# EAGLE design Touch (EAGLE 9.4.2)
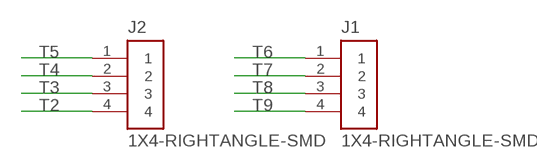
[diagram p0: schematic, sheet 1]

## Parts
J1  1X4-RIGHTANGLE-SMD  [1X4-RIGHTANGLE-SMD]
J2  1X4-RIGHTANGLE-SMD  [1X4-RIGHTANGLE-SMD]

## Nets
T2: J2.4
T3: J2.3
T4: J2.2
T5: J2.1
T6: J1.1
T7: J1.2
T8: J1.3
T9: J1.4

## Library data of the parts
J1 J2 = Actuator Circle:1X4-RIGHTANGLE-SMD

## Board
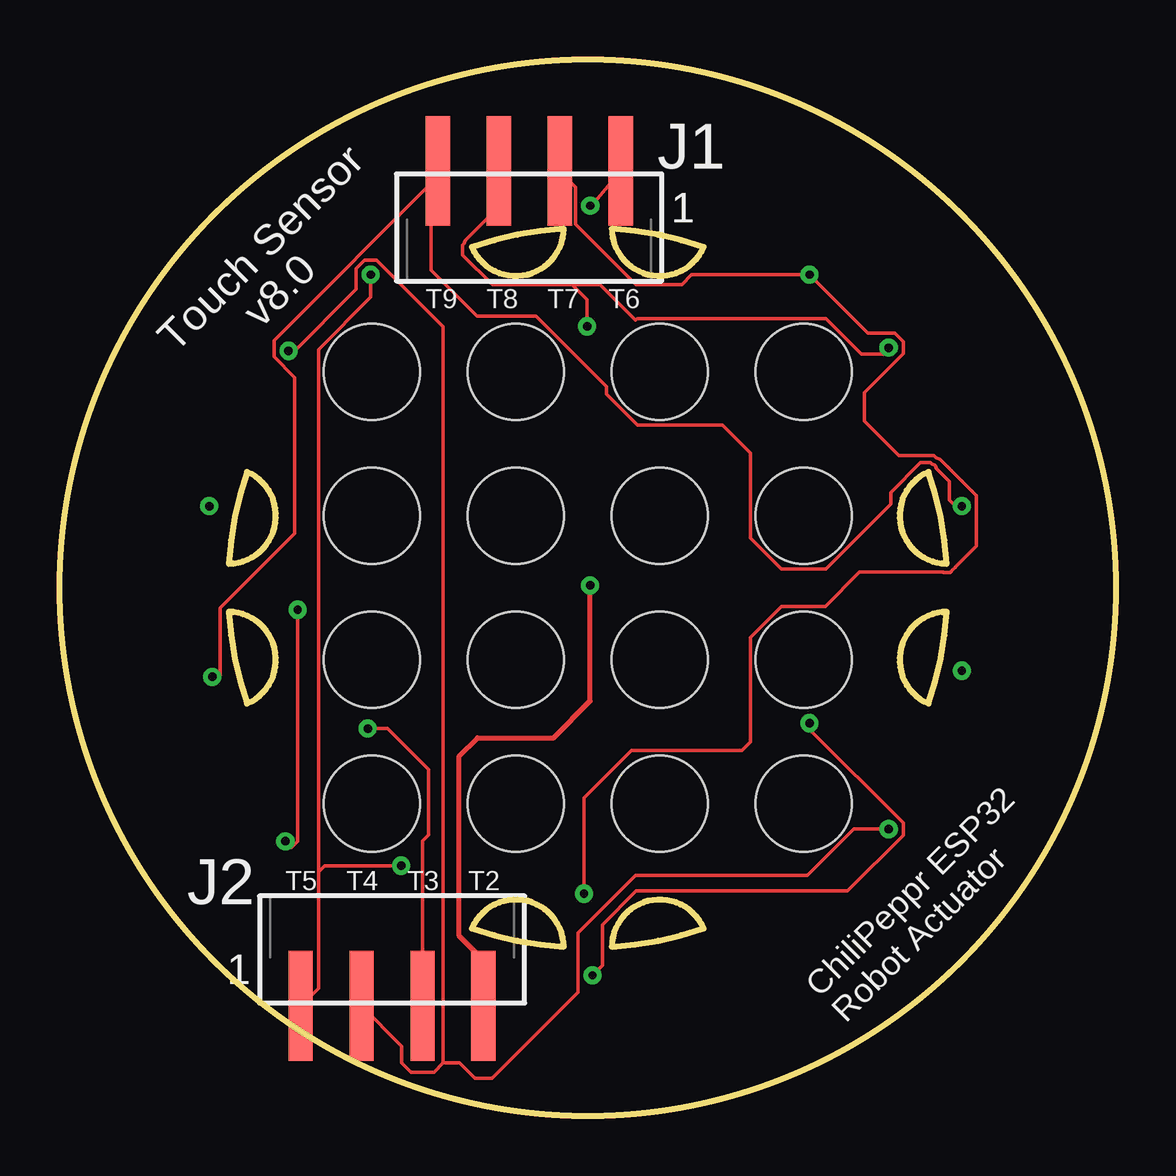
[diagram p1: board, top side]
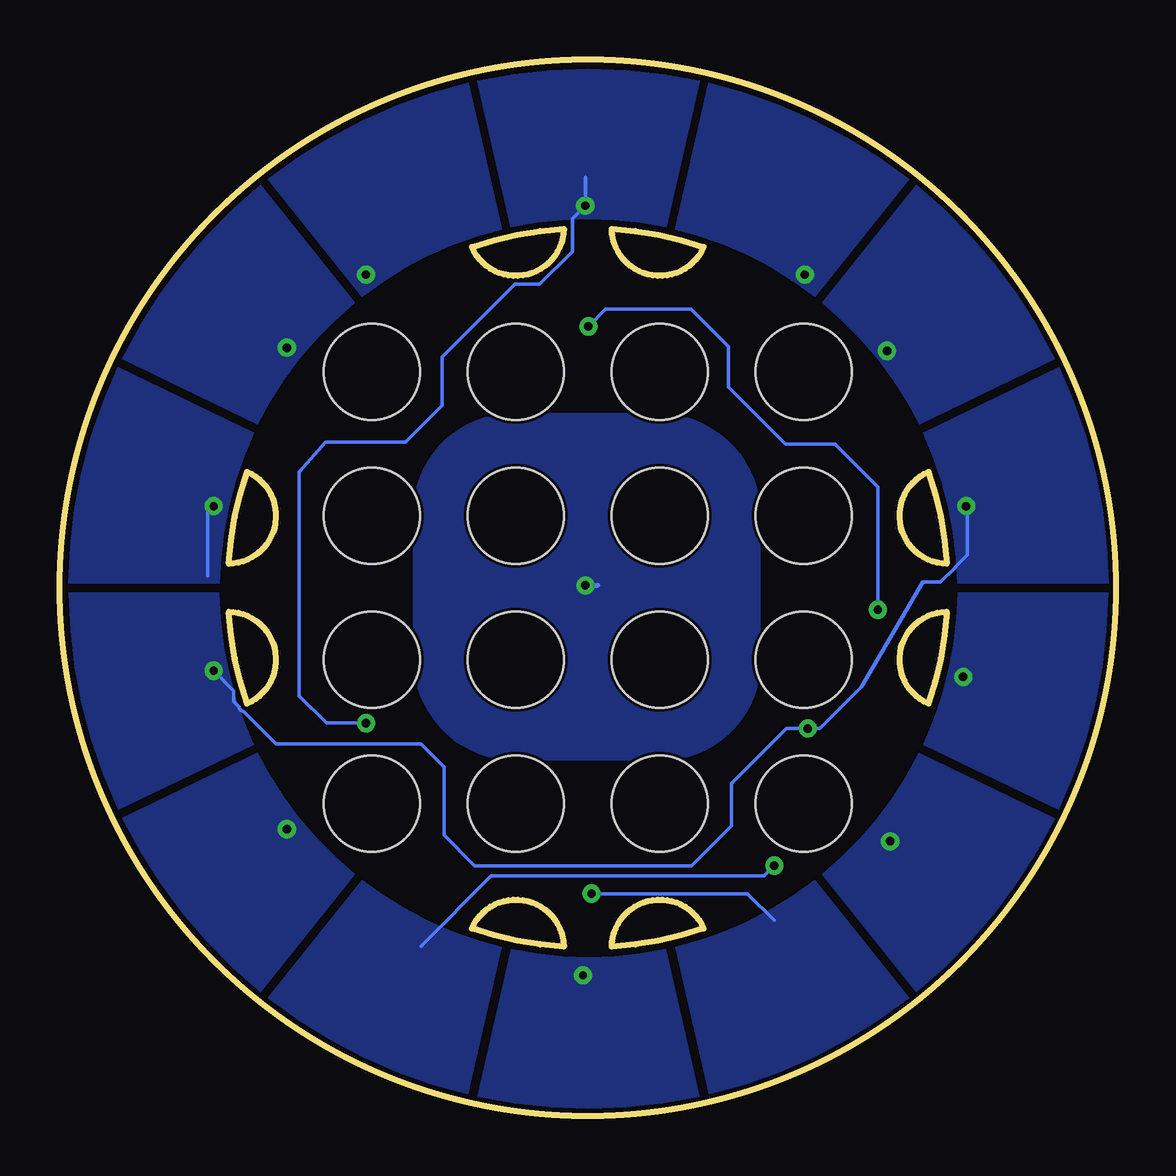
[diagram p2: board, bottom side, seen from below]

Size 44 x 44 mm. Coordinates in mm from the lower left corner, seen from the top.
Outline: 7.03,23 arc155 7.8,26.83 arc15 7.03,23
Outline: 36.2,26.83 arc155 36.97,23 arc15 36.2,26.83
Outline: 17.17,36.2 arc155 21,36.97 arc15 17.17,36.2
Outline: 23,36.97 arc155 26.83,36.2 arc15 23,36.97
Outline: 26.83,7.8 arc155 23,7.03 arc15 26.83,7.8
Outline: 7.03,21 arc15 7.8,17.17 arc155 7.03,21
Outline: 21,7.03 arc155 17.17,7.8 arc15 21,7.03
Outline: 36.97,21 arc155 36.2,17.17 arc15 36.97,21
Outline: circle at 22,22 radius 22
Copper layers (1*16): Top 0.035mm / dielectric 1.13mm / Bottom 0.035mm
Design rules "default *": minimum track width 6mil, minimum drill 0.35mm, track to track 6mil, track to pad 6mil, pad to pad 6mil, via to via 6mil, smd to smd 6mil, copper to edge 6mil, drill to drill 6mil, minimum pad ring 10mil, minimum via ring 8mil, stop-mask expansion 4mil, vias tented up to drill 0mil, thermal gap 10mil
Holes 4 mm at 31,25 25,31 19,31 31,13 19,13 25,25 19,25 19,19 25,13 25,19 31,19 31,31 13,31 13,19 13,13 13,25

### Footprints (pad centres in the part's own frame; a part is rotated, then mirrored left to right if it is on the bottom)
1X4-RIGHTANGLE-SMD = smd 1.016 x 4.572: 1 -3.81,-3.302; 2 -1.27,-3.302; 3 1.27,-3.302; 4 3.81,-3.302

### Placement (x,y rotation side)
J1  19.56,36.07 180 top
J2  13.84,7.87 0 top

### Tracks (layer width: path | path; a pad name or v marks a point on that pad's centre or on a via)
T2  (via drill 0.35)
  Top 0.203: J2.4 17.65,6.48 16.64,7.49 16.64,14.99 17.4,15.75 20.57,15.75 22.1,17.27 v22.1,22.1
  Bottom 0.203: v22.1,22.1 21.59,22.1
  pour Bottom: 19.05,29.21 arc90 14.86,25.02 14.86,24.89 14.86,18.92 arc90 18.92,14.86 19.05,14.86 25.02,14.86 arc90 29.21,19.05 29.21,25.15 arc90 25.15,29.21 25.02,29.21
T3  (via drill 0.35)
  Top 0.152: J2.3 15.11,11.45 15.36,11.7 15.36,14.43 13.65,16.14 v12.83,16.14 v12.83,16.13
  Bottom 0.152: v6.22,25.4 6.17,25.35 6.17,23.37 6.68,22.86 6.68,22.85 7.3,22.25 8.04,22.25 10.59,17.86 12.32,16.13 v12.83,16.13 13.72,16.13 16.01,13.84 16.01,12.08 17.67,10.41 26.71,10.41 27.99,11.7 27.99,14.53 28.96,15.49 35,15.49 36.34,16.84 36.47,16.89 36.47,16.91 36.49,16.91 36.5,16.96 36.53,17.04 36.76,17.26 36.76,17.71 v37.59,18.54
  pour Bottom: 2.37,31.19 arc25 0.31,22.17 6.58,22.17 arc-24 8.01,28.47
  pour Bottom: 41.57,12.75 35.92,15.47 arc24 37.36,21.77 43.63,21.77 arc-25
T4  (via drill 0.35)
  Top 0.152: 15.98,2.19 15.59,1.8 14.64,1.8 14.25,2.19 14.25,2.9 J2.2 | 15.98,2.19 15.98,32.89 13.21,35.66 12.7,35.66 12.35,35.3 12.35,34.45 9.65,31.75 v9.53,31.88 | 15.98,2.19 16.66,2.19 17.3,1.55 18,1.55 21.59,5.14 21.59,7.62 23.98,10.01 31.16,10.01 33.09,11.94 v34.54,11.94
  pour Bottom: 8.19,28.83 2.54,31.55 arc-25 8.31,38.78 12.22,33.88 arc24
  pour Bottom: 35.63,5.16 31.72,10.06 arc24 35.75,15.11 41.4,12.39 arc-25
T5  (via drill 0.35)
  Top 0.152: J2.1 10.77,5.31 10.77,10.16 | v12.95,35.05 12.95,34.11 10.77,31.92 10.77,10.16 | 10.77,10.16 11.03,10.41 v14.22,10.41
  Bottom 0.152: 28.96,7.06 26.04,9.98 14.66,9.98 v14.22,10.41
  pour Bottom: 16.95,43.05 arc25 8.62,39.03 12.53,34.13 arc-24 18.35,36.93
  pour Bottom: 26.98,0.9 25.59,7.01 arc24 31.41,9.81 35.32,4.91 arc-25
T6  (via drill 0.35)
  Top 0.152: J1.1 22.1,37.85 v22.1,37.93 | v31.24,16.36 31.24,16.1 35.15,12.19 35.15,11.69 32.82,9.36 24.02,9.36 22.61,7.95 22.61,6.25 v22.2,5.84
  Bottom 0.152: 22.1,39.12 v22.1,37.93 22.64,37.39 22.64,36.01 24.01,34.65 25.04,34.65 28.07,31.62 28.07,29.59 29.59,28.07 32.93,28.07 34.04,26.81 34.04,17.5 32.89,16.36 v31.24,16.36 31.24,16.26
  pour Bottom: 26.59,43.13 arc25 17.34,43.13 18.74,37.02 arc-24 25.2,37.02
  pour Bottom: 26.59,0.81 arc-25 17.34,0.81 18.74,6.92 arc24 25.2,6.92
T7  (via drill 0.35)
  Top 0.152: J1.2 21.5,38.7 21.5,37.16 24.02,34.64 25.92,34.64 26.33,35.05 v31.24,35.05 33.68,32.61 34.8,32.61 35.15,32.26 35.15,31.75 33.53,30.13 33.53,28.96 34.97,27.52 36.42,27.52 36.51,27.42 36.7,27.35 36.71,27.32 36.74,27.3 38.2,25.84 38.2,23.74 37.32,22.86 37.32,22.85 37.23,22.75 37.14,22.66 37.12,22.65 37.11,22.64 36.83,22.64 36.83,22.65 33.31,22.65 31.9,21.23 30.08,21.23 28.77,19.92 28.77,15.56 28.44,15.23 23.82,15.23 21.84,13.25 v21.84,9.25
  Bottom 0.152: v21.84,9.25 15.34,9.25 14.22,8.13
  pour Bottom: 26.98,43.05 25.59,36.93 arc-24 31.41,34.13 35.32,39.03 arc25
  pour Bottom: 16.95,0.9 arc-25 8.62,4.91 12.53,9.81 arc24 18.35,7.01
T8  (via drill 0.35)
  Top 0.152: J1.3 18.29,37.86 16.91,36.48 16.91,36.47 16.89,36.47 16.84,36.34 16.79,36.29 16.79,35.87 18.02,34.64 21.34,34.64 | 21.34,34.64 22.51,34.64 24,33.15 24.08,33.23 31.92,33.23 33.4,31.75 34.54,31.75 v34.54,32 | 21.34,34.64 21.97,34.01 v21.97,32.89 | v9.91,21.08 9.91,11.43 9.65,11.18 v9.4,11.43
  Bottom 0.152: v21.97,32.89 21.25,33.61 17.7,33.61 16.14,32.05 16.14,30.36 13.77,27.99 11.7,27.99 9.91,26.2 v9.91,21.08
  pour Bottom: 35.75,28.83 arc24 31.72,33.88 35.63,38.78 arc-25 41.4,31.55
  pour Bottom: 8.19,15.11 2.54,12.39 arc25 8.31,5.16 12.22,10.06 arc-24
T9  (via drill 0.35)
  Top 0.152: v37.59,25.4 37.47,25.27 37.07,25.67 37.07,26.42 36.53,26.96 36.49,27.09 36.47,27.09 36.47,27.11 36.34,27.16 36.29,27.21 35.87,27.21 34.64,25.98 34.64,25.49 31.92,22.77 30.08,22.77 28.77,24.08 28.77,27.62 27.62,28.77 24.08,28.77 22.77,30.08 22.77,30.39 19.84,33.32 17.39,33.32 15.47,35.24 15.47,39.09 J1.4 15.75,39.13 8.92,32.3 8.92,31.63 9.78,30.77 9.78,24.26 6.67,21.15 6.67,18.35 6.6,18.29 v6.35,18.29
  Bottom 0.152: v37.59,25.4 37.85,25.4 37.85,22.5
  pour Bottom: 41.57,31.19 35.92,28.47 arc-24 37.36,22.17 43.63,22.17 arc25
  pour Bottom: 2.37,12.75 arc-25 0.31,21.77 6.58,21.77 arc24 8.01,15.47

### Text on the board
tPlace: T9 | T8 | T7 | T6 | v8.0 | Touch Sensor | T5 | T4 | T3 | T2 | ChiliPeppr ESP32 / Robot Actuator